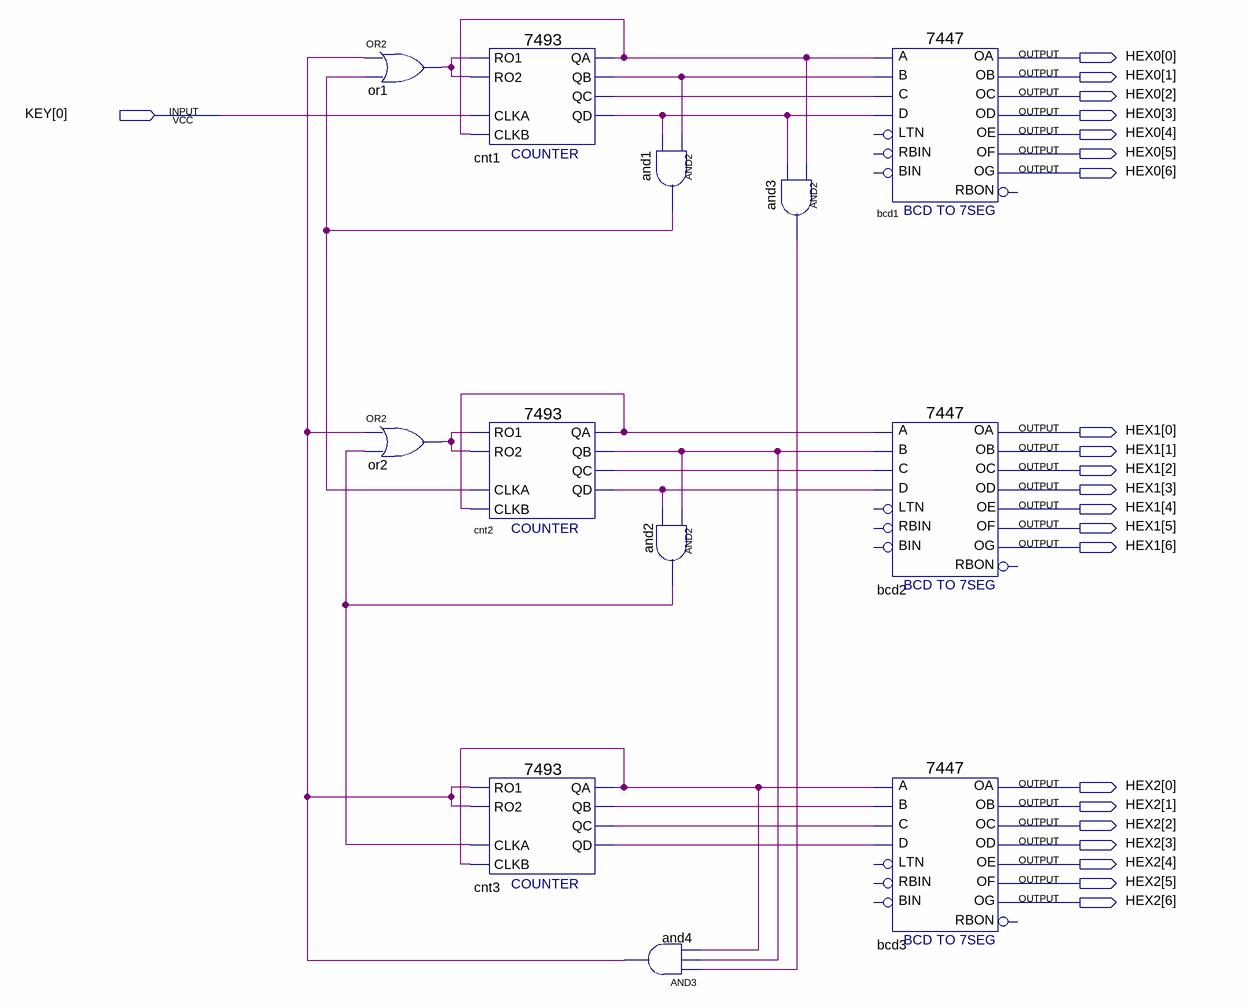
[diagram p0: schematic sheet]
// Quartus schematic dodatkowe.bdf as structural Verilog: 12 symbols, 22 pins
module dodatkowe (
  input  [0:0] KEY,
  output [6:0] HEX0,
  output [6:0] HEX1,
  output [6:0] HEX2
);

  wire and1_out, and2_out, and3_out, and4_out, cnt1_qa, cnt1_qb, cnt1_qc, cnt1_qd, cnt2_qa, cnt2_qb, cnt2_qc,
       cnt2_qd, cnt3_qa, cnt3_qb, cnt3_qc, cnt3_qd, or1_out, or2_out;

  or or1 (or1_out, and4_out, and1_out);
  or or2 (or2_out, and4_out, and2_out);
  \7493  cnt1 (
    .RO1(or1_out), .RO2(or1_out), .CLKA(KEY[0]), .CLKB(cnt1_qa), .QC(cnt1_qc), .QB(cnt1_qb), .QA(cnt1_qa),
    .QD(cnt1_qd));
  \7493  cnt2 (
    .RO1(or2_out), .RO2(or2_out), .CLKA(and1_out), .CLKB(cnt2_qa), .QC(cnt2_qc), .QB(cnt2_qb), .QA(cnt2_qa),
    .QD(cnt2_qd));
  \7493  cnt3 (
    .RO1(and4_out), .RO2(and4_out), .CLKA(and2_out), .CLKB(cnt3_qa), .QC(cnt3_qc), .QB(cnt3_qb),
    .QA(cnt3_qa), .QD(cnt3_qd));
  and and1 (and1_out, cnt1_qb, cnt1_qd);
  and and2 (and2_out, cnt2_qb, cnt2_qd);
  and and4 (and4_out, and3_out, cnt2_qb, cnt3_qa);
  and and3 (and3_out, cnt1_qa, cnt1_qd);
  \7447  bcd1 (
    .B(cnt1_qb), .C(cnt1_qc), .D(cnt1_qd), .A(cnt1_qa), .OB(HEX0[1]), .OC(HEX0[2]), .OE(HEX0[4]),
    .OD(HEX0[3]), .OF(HEX0[5]), .OG(HEX0[6]), .OA(HEX0[0]));  // open: LTN, RBIN, BIN, RBON
  \7447  bcd2 (
    .B(cnt2_qb), .C(cnt2_qc), .D(cnt2_qd), .A(cnt2_qa), .OB(HEX1[1]), .OC(HEX1[2]), .OE(HEX1[4]),
    .OD(HEX1[3]), .OF(HEX1[5]), .OG(HEX1[6]), .OA(HEX1[0]));  // open: LTN, RBIN, BIN, RBON
  \7447  bcd3 (
    .B(cnt3_qb), .C(cnt3_qc), .D(cnt3_qd), .A(cnt3_qa), .OB(HEX2[1]), .OC(HEX2[2]), .OE(HEX2[4]),
    .OD(HEX2[3]), .OF(HEX2[5]), .OG(HEX2[6]), .OA(HEX2[0]));  // open: LTN, RBIN, BIN, RBON
endmodule
